# Altium schematic sheet powerSupply.SchDoc
size A
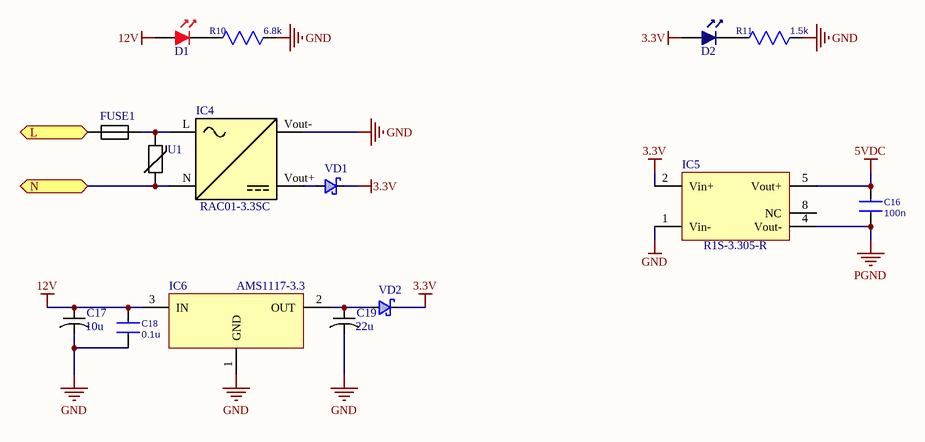
[diagram p0: powerSupply.SchDoc]

## Parts
C16  100n  [C_0603]
C17  10u  [TANTALUM_CAP_SIZE_A]
C18  0.1u  [C_0603]
C19  22u  [TANTALUM_CAP_SIZE_A]
D1  LED Red  [LED RED 3MM]  (value not drawn)
D2  LED Blue  [LED BLUE 3MM]  (value not drawn)
FUSE1  Fuse  [SF-2410FPXXXW]  (value not drawn)
IC4  RAC01-3.3SC  [RAC01-xxSGB]
IC5  R1S-3.305-R  [TES 1-0511]
IC6  AMS1117-3.3  [TO252AA]
R10  6.8k  [R_0603]
R11  1.5k  [R_0603]
U1  Varistor  [VARISTOR_45948]  (value not drawn)
VD1  Schottky Diode  [DO-214AA]  (value not drawn)
VD2  Schottky Diode  [DO-214AA]  (value not drawn)

## Ports
L (bidir), N (bidir)

## Nets
3.3V: D2.A IC5.2(Vin+) VD1.C VD2.C
5VDC: C16.2 IC5.5(Vout+)
12V: C17.1 C18.2 D1.A IC6.3(IN)
GND: C17.2 C18.1 C19.2 IC4.3(Vout-) IC5.1(Vin-) IC6.1(GND) R10.2 R11.2
PGND: C16.1 IC5.4(Vout-)
L: FUSE1.1 ; port L
N: IC4.2(VAC(N)) U1.2 ; port N
NetC19_1: C19.1 IC6.2(OUT) VD2.A
NetD1_C: D1.C R10.1
NetD2_C: D2.C R11.1
NetFUSE1_2: FUSE1.2 IC4.1(VAC(L)) U1.1
NetIC4_4: IC4.4(Vout+) VD1.A

Not connected (* = marked no-connect by the designer): IC5 8(NC)

## Notes on the sheet
- (in symbol AC/DC) L; N

## Library data of the parts
C16 C18 = C0603: Capacitor
  C16: Value: 100n
  C18: Value: 0.1u
C17 C19 = Tantalum Capacitor
IC4 = AC/DC
IC5 = TES 1-0511: Isolated DC/DC Converter; Link: https://eu.mouser.com/ProductDetail/TRACO-Power/TES-1-0511?qs=sGAEpiMZZMsF1ODjcwEocH3QqeL6%2foLAEyBjyRDduFs%3d
IC6 = AMS1117-3.3: 1A LOW DROPOUT VOLTAGE REGULATOR
R10 R11 = R0603: Resistor
  R10: Value: 6.8k
  R11: Value: 1.5k
VD1 VD2 = Schottky: SCHOTTKY BARRIER RECTIFIER